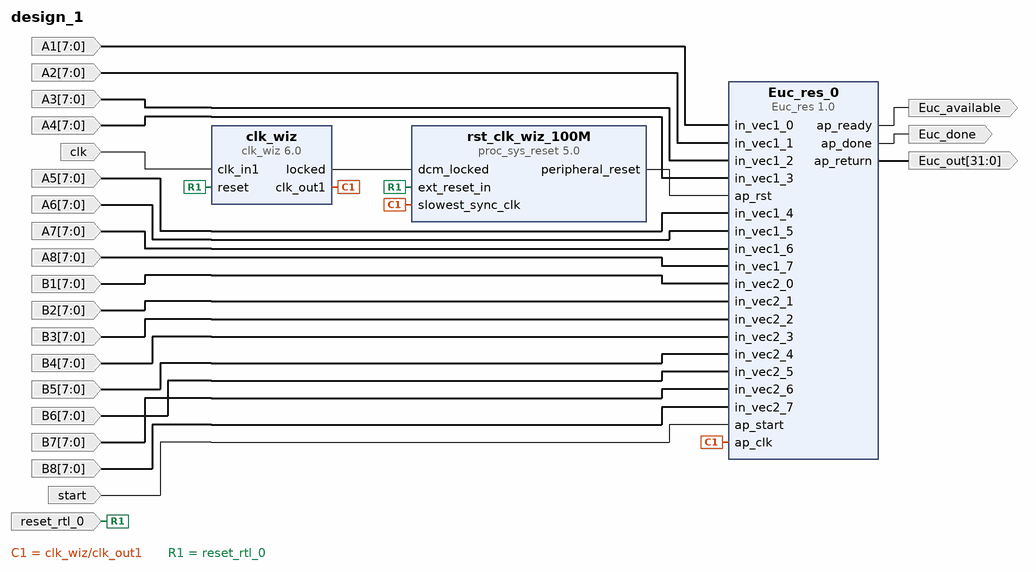
[diagram p0: block diagram of the top level]
# Vivado block design design_1, xc7a100tcsg324-1, Vivado 2021.1
create_bd_design design_1

create_bd_port -dir I -type clk clk
set_property -dict {CONFIG.FREQ_HZ 100000000} [get_bd_ports clk]
create_bd_port -dir O -from 31 -to 0 Euc_out
create_bd_port -dir I -type rst reset_rtl_0
set_property -dict {CONFIG.POLARITY ACTIVE_HIGH} [get_bd_ports reset_rtl_0]
create_bd_port -dir I -from 7 -to 0 A3
create_bd_port -dir I -from 7 -to 0 A2
create_bd_port -dir I -from 7 -to 0 A1
create_bd_port -dir I -from 7 -to 0 A4
create_bd_port -dir I -from 7 -to 0 A5
create_bd_port -dir I -from 7 -to 0 A6
create_bd_port -dir I -from 7 -to 0 A7
create_bd_port -dir I -from 7 -to 0 B1
create_bd_port -dir I -from 7 -to 0 B2
create_bd_port -dir I -from 7 -to 0 B3
create_bd_port -dir I -from 7 -to 0 B4
create_bd_port -dir I -from 7 -to 0 B5
create_bd_port -dir I -from 7 -to 0 B6
create_bd_port -dir I -from 7 -to 0 B7
create_bd_port -dir I -from 7 -to 0 B8
create_bd_port -dir I -from 7 -to 0 A8
create_bd_port -dir I start
create_bd_port -dir O Euc_available
create_bd_port -dir O Euc_done

create_bd_cell -type ip -vlnv xilinx.com:hls:Euc_res:1.0 Euc_res_0
create_bd_cell -type ip -vlnv xilinx.com:ip:clk_wiz:6.0 clk_wiz
create_bd_cell -type ip -vlnv xilinx.com:ip:proc_sys_reset:5.0 rst_clk_wiz_100M

# ---- connections ----

connect_bd_net -net A1_1 [get_bd_ports A1] [get_bd_pins Euc_res_0/in_vec1_0]
connect_bd_net -net A2_1 [get_bd_ports A2] [get_bd_pins Euc_res_0/in_vec1_1]
connect_bd_net -net A3_1 [get_bd_ports A3] [get_bd_pins Euc_res_0/in_vec1_2]
connect_bd_net -net A4_1 [get_bd_ports A4] [get_bd_pins Euc_res_0/in_vec1_3]
connect_bd_net -net A5_1 [get_bd_ports A5] [get_bd_pins Euc_res_0/in_vec1_4]
connect_bd_net -net A6_1 [get_bd_ports A6] [get_bd_pins Euc_res_0/in_vec1_5]
connect_bd_net -net A7_1 [get_bd_ports A7] [get_bd_pins Euc_res_0/in_vec1_6]
connect_bd_net -net A8_1 [get_bd_ports A8] [get_bd_pins Euc_res_0/in_vec1_7]
connect_bd_net -net B1_1 [get_bd_ports B1] [get_bd_pins Euc_res_0/in_vec2_0]
connect_bd_net -net B2_1 [get_bd_ports B2] [get_bd_pins Euc_res_0/in_vec2_1]
connect_bd_net -net B3_1 [get_bd_ports B3] [get_bd_pins Euc_res_0/in_vec2_2]
connect_bd_net -net B4_1 [get_bd_ports B4] [get_bd_pins Euc_res_0/in_vec2_3]
connect_bd_net -net B5_1 [get_bd_ports B5] [get_bd_pins Euc_res_0/in_vec2_4]
connect_bd_net -net B6_1 [get_bd_ports B6] [get_bd_pins Euc_res_0/in_vec2_5]
connect_bd_net -net B7_1 [get_bd_ports B7] [get_bd_pins Euc_res_0/in_vec2_6]
connect_bd_net -net B8_1 [get_bd_ports B8] [get_bd_pins Euc_res_0/in_vec2_7]
connect_bd_net [get_bd_pins Euc_res_0/ap_done] [get_bd_ports Euc_done]
connect_bd_net [get_bd_pins Euc_res_0/ap_ready] [get_bd_ports Euc_available]
connect_bd_net [get_bd_pins Euc_res_0/ap_return] [get_bd_ports Euc_out]
connect_bd_net [get_bd_ports clk] [get_bd_pins clk_wiz/clk_in1]
connect_bd_net [get_bd_pins clk_wiz/clk_out1] [get_bd_pins Euc_res_0/ap_clk] [get_bd_pins rst_clk_wiz_100M/slowest_sync_clk]
connect_bd_net [get_bd_pins clk_wiz/locked] [get_bd_pins rst_clk_wiz_100M/dcm_locked]
connect_bd_net -net reset_rtl_0_1 [get_bd_ports reset_rtl_0] [get_bd_pins clk_wiz/reset] [get_bd_pins rst_clk_wiz_100M/ext_reset_in]
connect_bd_net [get_bd_pins rst_clk_wiz_100M/peripheral_reset] [get_bd_pins Euc_res_0/ap_rst]
connect_bd_net [get_bd_ports start] [get_bd_pins Euc_res_0/ap_start]

validate_bd_design
save_bd_design
